# Altium schematic sheet Sheet_AIO_Shield.SchDoc
size A4
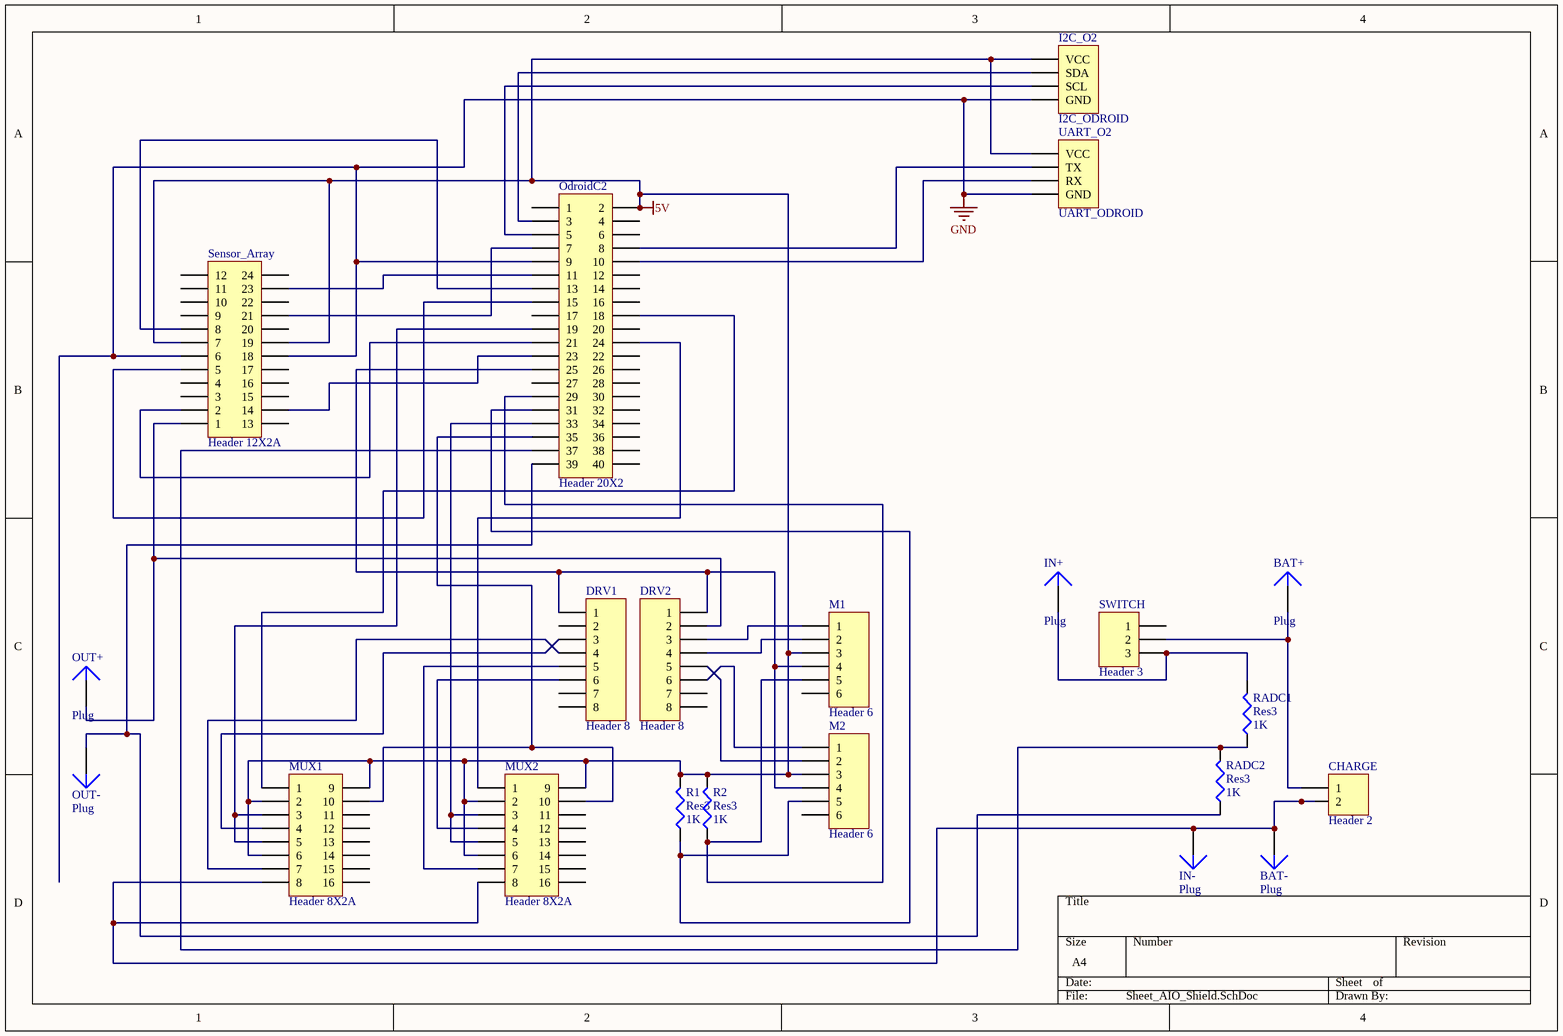
[diagram p0: Sheet_AIO_Shield.SchDoc]

## Parts
BAT+  Plug  [PIN1]
BAT-  Plug  [PIN1]
CHARGE  Header 2  [HDR1X2]
DRV1  Header 8  [HDR1X8]
DRV2  Header 8  [HDR1X8]
I2C_O2  I2C_ODROID  [HDR1X4]
IN+  Plug  [PIN1]
IN-  Plug  [PIN1]
M1  Header 6  [HDR1X6]
M2  Header 6  [HDR1X6]
MUX1  Header 8X2A  [N016]
MUX2  Header 8X2A  [N016]
OdroidC2  Header 20X2  [HDR2X20]
OUT+  Plug  [PIN1]
OUT-  Plug  [PIN1]
R1  Res3  value 1K  [INDC3216]
R2  Res3  value 1K  [INDC3216]
RADC1  Res3  value 1K  [INDC3216]
RADC2  Res3  value 1K  [INDC3216]
Sensor_Array  Header 12X2A  [HDR2X12_CEN]
SWITCH  Header 3  [HDR1X3]
UART_O2  UART_ODROID  [HDR1X4]

## Nets
5V: I2C_O2.1(VCC) M1.3 M2.3 MUX1.2 MUX1.6 MUX1.16(9) MUX2.2 MUX2.6 MUX2.16(9) OdroidC2.2 R1.2 R2.2 Sensor_Array.7 Sensor_Array.19 UART_O2.1(VCC)
GND: I2C_O2.4(GND) OdroidC2.9 Sensor_Array.6 Sensor_Array.18 UART_O2.4(GND)
NetBAT+_1: BAT+.1 CHARGE.1 SWITCH.2
NetBAT-_1: BAT-.1 CHARGE.2 IN-.1 MUX1.8 MUX2.8
NetDRV1_1: DRV1.1 DRV2.1 M1.4 M2.4 OdroidC2.25
NetDRV1_3: DRV1.3 MUX1.4
NetDRV1_4: DRV1.4 MUX1.7
NetDRV1_5: DRV1.5 MUX2.7
NetDRV1_6: DRV1.6 MUX2.4
NetDRV2_2: DRV2.2 OUT+.1 Sensor_Array.1
NetDRV2_3: DRV2.3 M1.1
NetDRV2_4: DRV2.4 M1.2
NetDRV2_5: DRV2.5 M2.2
NetDRV2_6: DRV2.6 M2.1
NetI2C_O2_2: I2C_O2.2(SDA) OdroidC2.3
NetI2C_O2_3: I2C_O2.3(SCL) OdroidC2.5
NetIN+_1: IN+.1 RADC1.2 SWITCH.3
NetM1_5: M1.5 OdroidC2.29 R2.1
NetM2_5: M2.5 OdroidC2.31 R1.1
NetMUX1_1: MUX1.1 OdroidC2.18
NetMUX1_3: MUX1.3 MUX1.5 OdroidC2.19
NetMUX1_15: MUX1.15(10) MUX2.15(10) OdroidC2.35
NetMUX2_1: MUX2.1 OdroidC2.24
NetMUX2_3: MUX2.3 MUX2.5 OdroidC2.33
NetOdroidC2_7: OdroidC2.7 Sensor_Array.21
NetOdroidC2_8: OdroidC2.8 UART_O2.3(TX)
NetOdroidC2_10: OdroidC2.10 UART_O2.2(RX)
NetOdroidC2_11: OdroidC2.11 Sensor_Array.23
NetOdroidC2_13: OdroidC2.13 Sensor_Array.8
NetOdroidC2_15: OdroidC2.15 Sensor_Array.5
NetOdroidC2_21: OdroidC2.21 Sensor_Array.2
NetOdroidC2_23: OdroidC2.23 Sensor_Array.14
NetOdroidC2_37: OdroidC2.37 RADC1.1 RADC2.2
NetOdroidC2_39: OdroidC2.39 OUT-.1 RADC2.1

Not connected (* = marked no-connect by the designer): DRV1 2 7 8; DRV2 7 8; M1 6; M2 6; MUX1 9(16) 10(15) 11(14) 12(13) 13(12) 14(11); MUX2 9(16) 10(15) 11(14) 12(13) 13(12) 14(11); OdroidC2 1 4 6 12 14 16 17 20 22 26 27 28 30 32 34 36 38 40; Sensor_Array 3 4 9 10 11 12 13 15 16 17 20 22 24; SWITCH 1

## Library data of the parts
CHARGE = Header 2: Header, 2-Pin; LatestRevisionDate: 17-Jul-2002; LatestRevisionNote: Re-released for DXP Platform.; Publisher: Altium Limited
DRV1 DRV2 = Header 8: Header, 8-Pin; LatestRevisionDate: 17-Jul-2002; LatestRevisionNote: Re-released for DXP Platform.; Publisher: Altium Limited
I2C_O2 UART_O2 = Header 4: Header, 4-Pin; LatestRevisionDate: 17-Jul-2002; LatestRevisionNote: Re-released for DXP Platform.; Publisher: Altium Limited
M1 M2 = Header 6: Header, 6-Pin; LatestRevisionDate: 17-Jul-2002; LatestRevisionNote: Re-released for DXP Platform.; Publisher: Altium Limited
MUX1 MUX2 = Header 8X2A: Header, 8-Pin, Dual row; LatestRevisionDate: 17-Jul-2002; LatestRevisionNote: Re-released for DXP Platform.; Publisher: Altium Limited
OdroidC2 = Header 20X2: Header, 20-Pin, Dual row; LatestRevisionDate: 17-Jul-2002; LatestRevisionNote: Re-released for DXP Platform.; Publisher: Altium Limited
R1 R2 RADC1 RADC2 = Res3: Resistor; Published: 8-Jun-2000; LatestRevisionDate: 29-May-2009; LatestRevisionNote: IPC-7351 Footprint Added.; PackageReference: J1-0603; Publisher: Altium Limited; PackageDescription: Chip Resistor
Sensor_Array = Header 12X2A: Header, 12-Pin, Dual row; LatestRevisionDate: 17-Jul-2002; LatestRevisionNote: Re-released for DXP Platform.; Publisher: Altium Limited
SWITCH = Header 3: Header, 3-Pin; LatestRevisionDate: 17-Jul-2002; LatestRevisionNote: Re-released for DXP Platform.; Publisher: Altium Limited
BAT+ BAT- IN+ IN- OUT+ OUT- = Plug: LatestRevisionDate: 17-Jul-2002; LatestRevisionNote: Re-released for DXP Platform.; Publisher: Altium Limited